# EAGLE schematic USB_Hub_v1.0 (EAGLE 9.5.2)
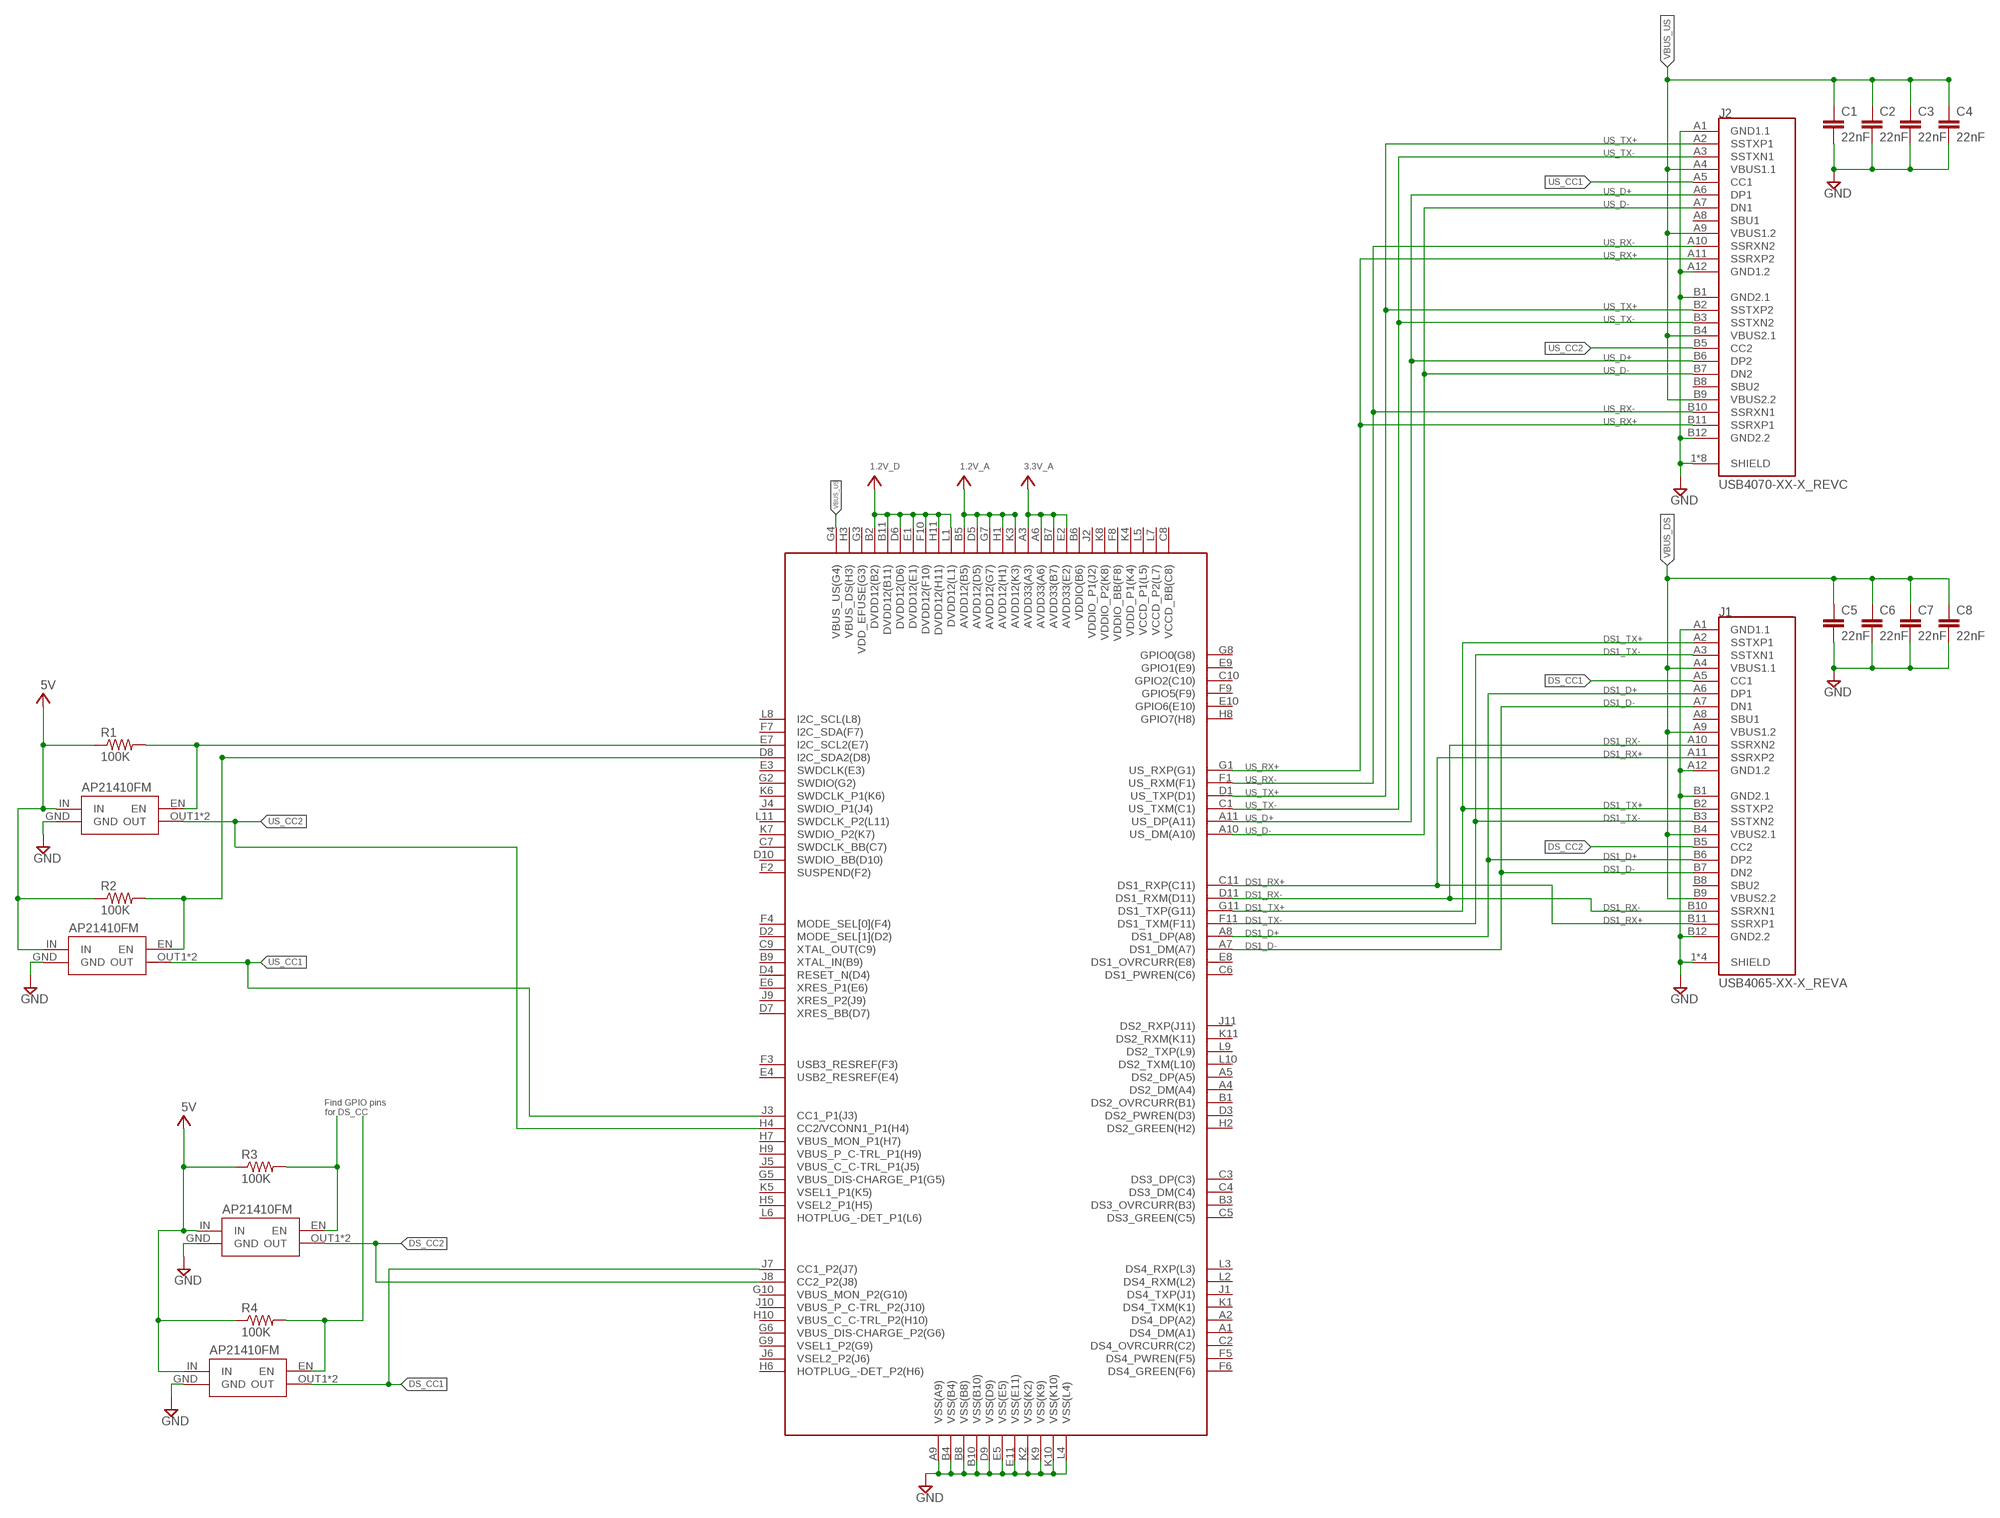
[diagram p0: schematic, sheet 1]

## Parts
C1  22nF  22NF/22,000PF-0603-50V-10%  [0603]
C2  22nF  22NF/22,000PF-0603-50V-10%  [0603]
C3  22nF  22NF/22,000PF-0603-50V-10%  [0603]
C4  22nF  22NF/22,000PF-0603-50V-10%  [0603]
C5  22nF  22NF/22,000PF-0603-50V-10%  [0603]
C6  22nF  22NF/22,000PF-0603-50V-10%  [0603]
C7  22nF  22NF/22,000PF-0603-50V-10%  [0603]
C8  22nF  22NF/22,000PF-0603-50V-10%  [0603]
J1  USB4065-XX-X_REVA  [GCT_USB4065-XX-X_REVA]
J2  USB4070-XX-X_REVC  [GCT_USB4070-XX-X_REVC]
R1  100K  R-US_R0603  [R0603]
R2  100K  R-US_R0603  [R0603]
R3  100K  R-US_R0603  [R0603]
R4  100K  R-US_R0603  [R0603]
U$1  CYUSB33X3  [CYUSB33X3]
U$2  AP21410  [AP21410]
U$3  AP21410  [AP21410]
U$4  AP21410  [AP21410]
U$5  AP21410  [AP21410]

## Nets
1.2V_A: U$1.B5(AVDD12(B5)) U$1.D5(AVDD12(D5)) U$1.G7(AVDD12(G7)) U$1.H1(AVDD12(H1)) U$1.K3(AVDD12(K3)) ; supply symbol labelled VCC
1.2V_D: U$1.B2(DVDD12(B2)) U$1.B11(DVDD12(B11)) U$1.D6(DVDD12(D6)) U$1.E1(DVDD12(E1)) U$1.F10(DVDD12(F10)) U$1.H11(DVDD12(H11)) U$1.L1(DVDD12(L1)) ; supply symbol labelled VCC
3.3V_A: U$1.A3(AVDD33(A3)) U$1.A6(AVDD33(A6)) U$1.B7(AVDD33(B7)) U$1.E2(AVDD33(E2)) ; supply symbol labelled VCC
5V: R1.1 R2.1 R3.1 R4.1 U$2.IN U$3.IN U$4.IN U$5.IN
DS1_D+: J1.A6(DP1) J1.B6(DP2) U$1.A8(DS1_DP(A8))
DS1_D-: J1.A7(DN1) J1.B7(DN2) U$1.A7(DS1_DM(A7))
DS1_RX+: J1.A11(SSRXP2) J1.B11(SSRXP1) U$1.C11(DS1_RXP(C11))
DS1_RX-: J1.A10(SSRXN2) J1.B10(SSRXN1) U$1.D11(DS1_RXM(D11))
DS1_TX+: J1.A2(SSTXP1) J1.B2(SSTXP2) U$1.G11(DS1_TXP(G11))
DS1_TX-: J1.A3(SSTXN1) J1.B3(SSTXN2) U$1.F11(DS1_TXM(F11))
DS_CC1: J1.A5(CC1) U$1.J7(CC1_P2(J7)) U$5.OUT1(OUT) U$5.OUT2(OUT)
DS_CC2: J1.B5(CC2) U$1.J8(CC2_P2(J8)) U$4.OUT1(OUT) U$4.OUT2(OUT)
GND: C1.2 C2.2 C3.2 C4.2 C5.2 C6.2 C7.2 C8.2 J1.1(SHIELD) J1.2(SHIELD) J1.3(SHIELD) J1.4(SHIELD) J1.A1(GND1.1) J1.A12(GND1.2) J1.B1(GND2.1) J1.B12(GND2.2) J2.1(SHIELD) J2.2(SHIELD) J2.3(SHIELD) J2.4(SHIELD) J2.5(SHIELD) J2.6(SHIELD) J2.7(SHIELD) J2.8(SHIELD) J2.A1(GND1.1) J2.A12(GND1.2) J2.B1(GND2.1) J2.B12(GND2.2) U$1.A9(VSS(A9)) U$1.B4(VSS(B4)) U$1.B8(VSS(B8)) U$1.B10(VSS(B10)) U$1.D9(VSS(D9)) U$1.E5(VSS(E5)) U$1.E11(VSS(E11)) U$1.K2(VSS(K2)) U$1.K9(VSS(K9)) U$1.K10(VSS(K10)) U$1.L4(VSS(L4)) U$2.GND U$3.GND U$4.GND U$5.GND
N$1: R1.2 U$1.E7(I2C_SCL2(E7)) U$2.EN
N$3: R2.2 U$1.D8(I2C_SDA2(D8)) U$3.EN
N$5: R3.2 U$4.EN
N$6: R4.2 U$5.EN
US_CC1: J2.A5(CC1) U$1.J3(CC1_P1(J3)) U$3.OUT1(OUT) U$3.OUT2(OUT)
US_CC2: J2.B5(CC2) U$1.H4(CC2/VCONN1_P1(H4)) U$2.OUT1(OUT) U$2.OUT2(OUT)
US_D+: J2.A6(DP1) J2.B6(DP2) U$1.A11(US_DP(A11))
US_D-: J2.A7(DN1) J2.B7(DN2) U$1.A10(US_DM(A10))
US_RX+: J2.A11(SSRXP2) J2.B11(SSRXP1) U$1.G1(US_RXP(G1))
US_RX-: J2.A10(SSRXN2) J2.B10(SSRXN1) U$1.F1(US_RXM(F1))
US_TX+: J2.A2(SSTXP1) J2.B2(SSTXP2) U$1.D1(US_TXP(D1))
US_TX-: J2.A3(SSTXN1) J2.B3(SSTXN2) U$1.C1(US_TXM(C1))
VBUS_DS: C5.1 C6.1 C7.1 C8.1 J1.A4(VBUS1.1) J1.A9(VBUS1.2) J1.B4(VBUS2.1) J1.B9(VBUS2.2)
VBUS_US: C1.1 C2.1 C3.1 C4.1 J2.A4(VBUS1.1) J2.A9(VBUS1.2) J2.B4(VBUS2.1) J2.B9(VBUS2.2) U$1.G4(VBUS_US(G4))
Unconnected: J1.A8(SBU1) J1.B8(SBU2) J2.A8(SBU1) J2.B8(SBU2) U$1.A1(DS4_DM(A1)) U$1.A2(DS4_DP(A2)) U$1.A4(DS2_DM(A4)) U$1.A5(DS2_DP(A5)) U$1.B1(DS2_OVRCURR(B1)) U$1.B3(DS3_OVRCURR(B3)) U$1.B6(VDDIO(B6)) U$1.B9(XTAL_IN(B9)) U$1.C2(DS4_OVRCURR(C2)) U$1.C3(DS3_DP(C3)) U$1.C4(DS3_DM(C4)) U$1.C5(DS3_GREEN(C5)) U$1.C6(DS1_PWREN(C6)) U$1.C7(SWDCLK_BB(C7)) U$1.C8(VCCD_BB(C8)) U$1.C9(XTAL_OUT(C9)) U$1.C10(GPIO2(C10)) U$1.D2(MODE_SEL[1](D2)) U$1.D3(DS2_PWREN(D3)) U$1.D4(RESET_N(D4)) U$1.D7(XRES_BB(D7)) U$1.D10(SWDIO_BB(D10)) U$1.E3(SWDCLK(E3)) U$1.E4(USB2_RESREF(E4)) U$1.E6(XRES_P1(E6)) U$1.E8(DS1_OVRCURR(E8)) U$1.E9(GPIO1(E9)) U$1.E10(GPIO6(E10)) U$1.F2(SUSPEND(F2)) U$1.F3(USB3_RESREF(F3)) U$1.F4(MODE_SEL[0](F4)) U$1.F5(DS4_PWREN(F5)) U$1.F6(DS4_GREEN(F6)) U$1.F7(I2C_SDA(F7)) U$1.F8(VDDIO_BB(F8)) U$1.F9(GPIO5(F9)) U$1.G2(SWDIO(G2)) U$1.G3(VDD_EFUSE(G3)) U$1.G5(VBUS_DIS-CHARGE_P1(G5)) U$1.G6(VBUS_DIS-CHARGE_P2(G6)) U$1.G8(GPIO0(G8)) U$1.G9(VSEL1_P2(G9)) U$1.G10(VBUS_MON_P2(G10)) U$1.H2(DS2_GREEN(H2)) U$1.H3(VBUS_DS(H3)) U$1.H5(VSEL2_P1(H5)) U$1.H6(HOTPLUG_-DET_P2(H6)) U$1.H7(VBUS_MON_P1(H7)) U$1.H8(GPIO7(H8)) U$1.H9(VBUS_P_C-TRL_P1(H9)) U$1.H10(VBUS_C_C-TRL_P2(H10)) U$1.J1(DS4_TXP(J1)) U$1.J2(VDDIO_P1(J2)) U$1.J4(SWDIO_P1(J4)) U$1.J5(VBUS_C_C-TRL_P1(J5)) U$1.J6(VSEL2_P2(J6)) U$1.J9(XRES_P2(J9)) U$1.J10(VBUS_P_C-TRL_P2(J10)) U$1.J11(DS2_RXP(J11)) U$1.K1(DS4_TXM(K1)) U$1.K4(VDDD_P1(K4)) U$1.K5(VSEL1_P1(K5)) U$1.K6(SWDCLK_P1(K6)) U$1.K7(SWDIO_P2(K7)) U$1.K8(VDDIO_P2(K8)) U$1.K11(DS2_RXM(K11)) U$1.L2(DS4_RXM(L2)) U$1.L3(DS4_RXP(L3)) U$1.L5(VCCD_P1(L5)) U$1.L6(HOTPLUG_-DET_P1(L6)) U$1.L7(VCCD_P2(L7)) U$1.L8(I2C_SCL(L8)) U$1.L9(DS2_TXP(L9)) U$1.L10(DS2_TXM(L10)) U$1.L11(SWDCLK_P2(L11))

## Notes on the sheet
- Find GPIO pins
  for DS_CC

## Library data of the parts
C1-C8 = SparkFun-Capacitors:22NF/22,000PF: 0.022uF/22nF/22,000pF ceramic capacitors A capacitor is a passive two-terminal electrical component used to store electrical energy temporarily in an electric field.; PROD_ID: CAP-07885
J1 = USB4065-XX-X_REVA:USB4065-XX-X_REVA: USB Receptacle, Type C, Hybrid Type, PCB Top Mount; AVAILABILITY: Unavailable; DESCRIPTION: USB Type C Receptacle Horizontal Hybrid PCB Top Mount 8.65 mm Body; MF: Global Connector Technology; MP: USB4065-30-A; PACKAGE: None; PRICE: None
J2 = USB4070-XX-X_REVC:USB4070-XX-X_REVC: USB Type C Receptacle, Vertical, SMT with Shell Stakes & Locating Pegs; AVAILABILITY: Unavailable; DESCRIPTION: Usb Type c Rec. 30 , Vertical, Smt With Stakes & Pegs, Tray; MF: Global Connector Technology; MP: USB4070-30-B; PACKAGE: None; PRICE: None
R1-R4 = resistor:R-US_: RESISTOR, American symbol
U$1 = CYUSB33X3:CYUSB33X3
U$2-U$5 = AP21410FM-7:AP21410